# EAGLE design SKEMA ALAT UKUR-2025 (EAGLE 7.7.0)
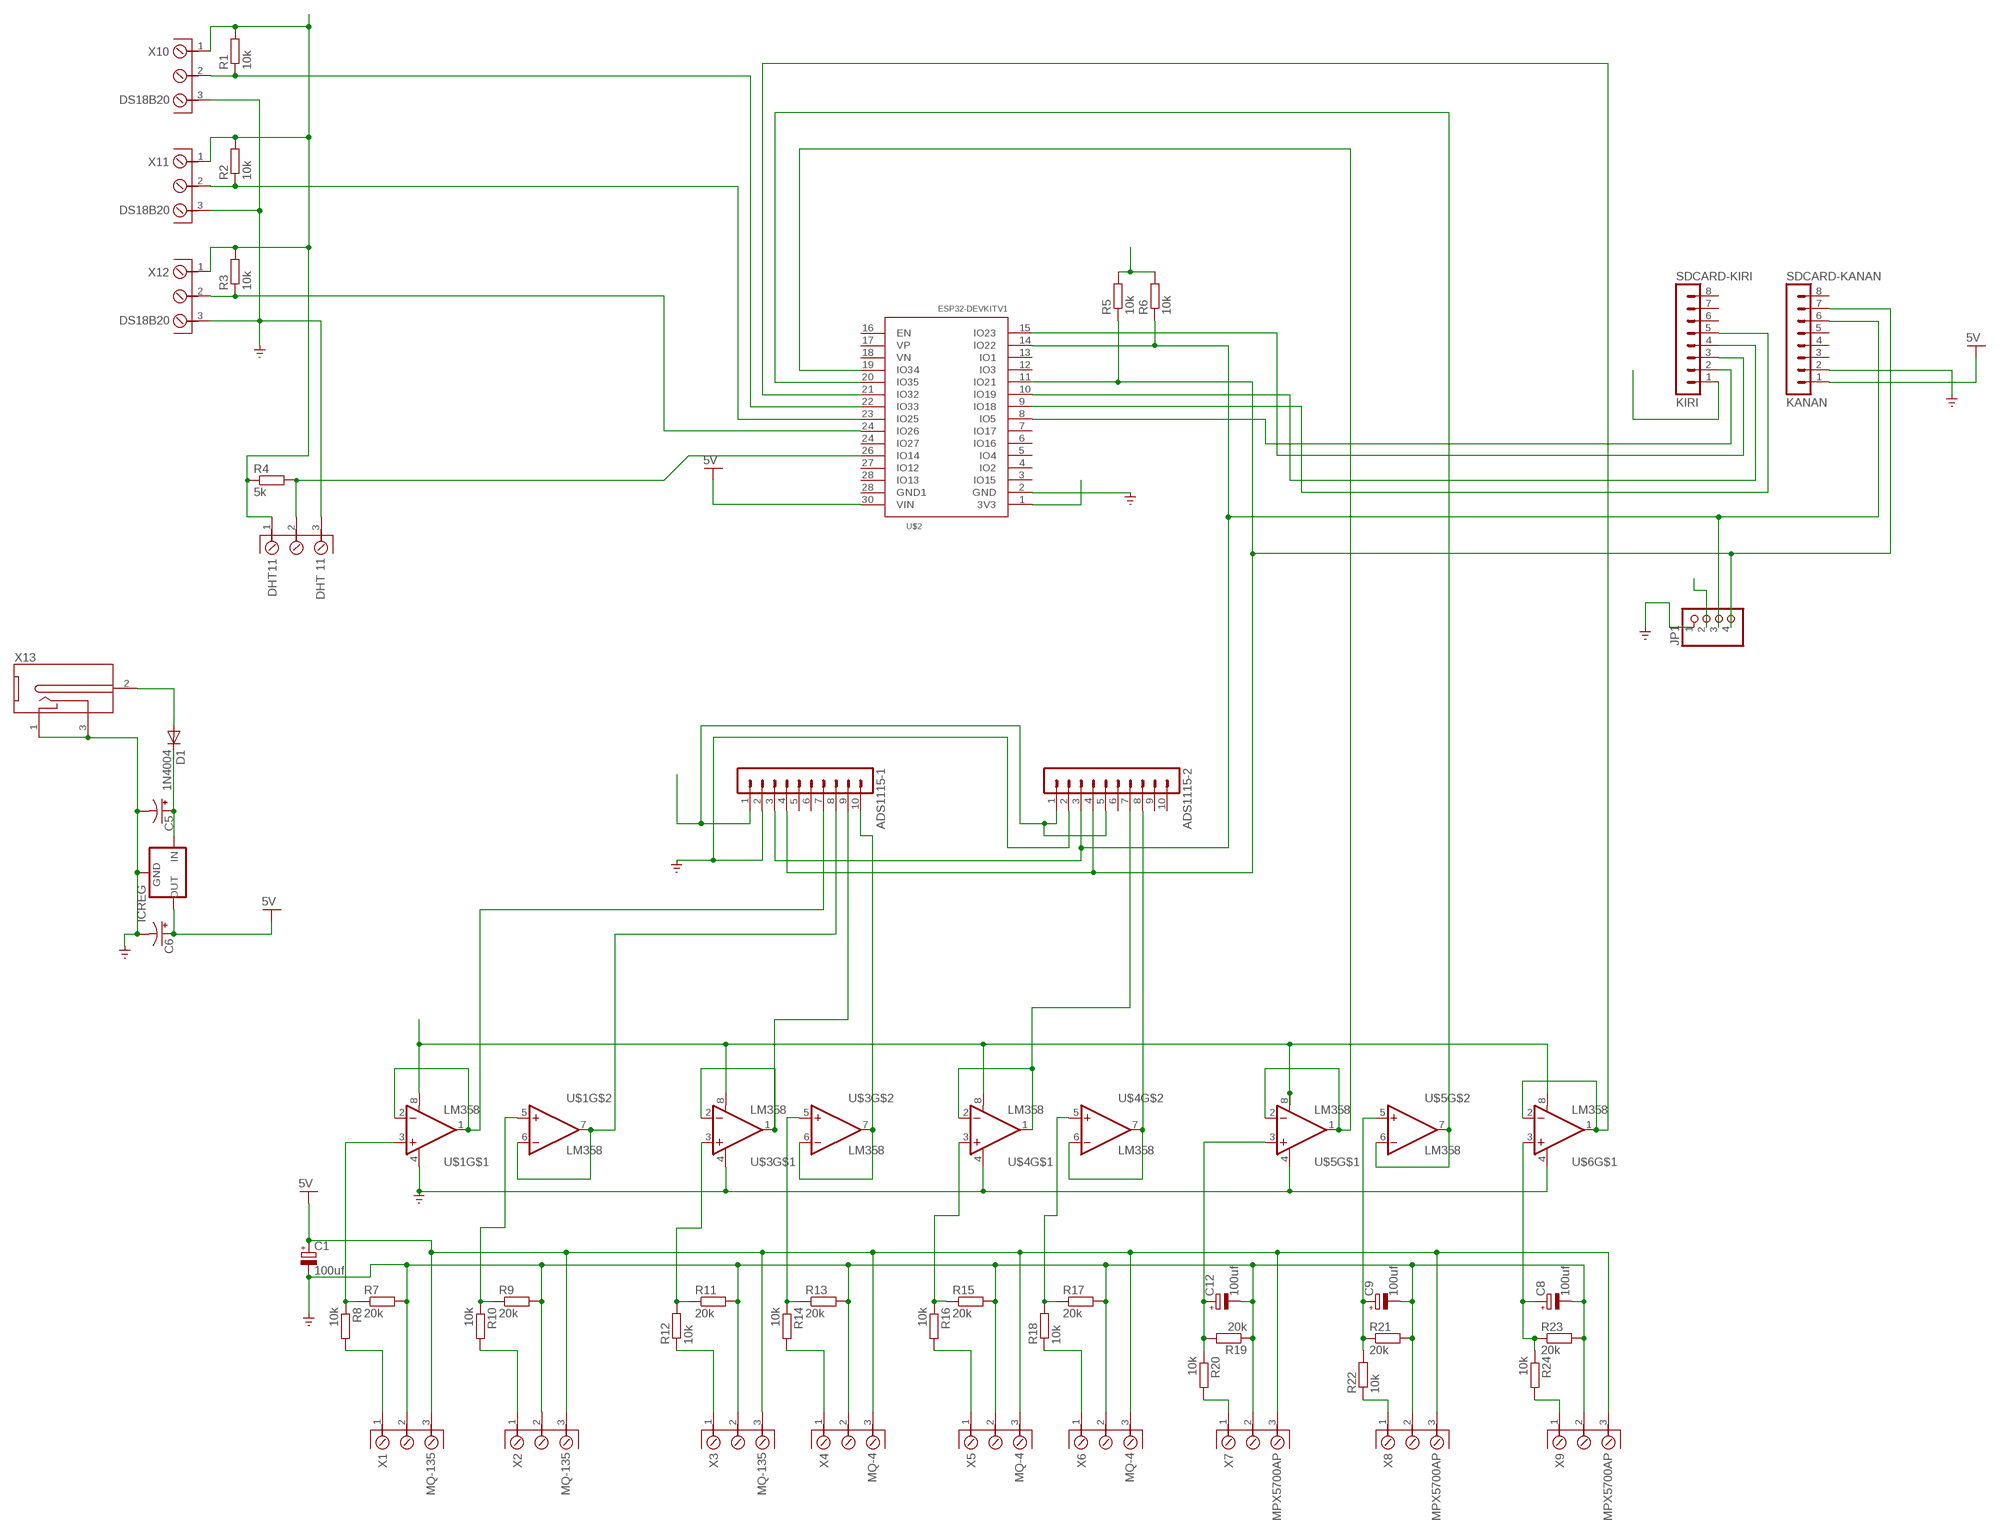
[diagram p0: schematic, sheet 1]

## Parts
ADS1115-1  MA10-1  [MA10-1]
ADS1115-2  MA10-1  [MA10-1]
C1  100uf  CPOL-EUE5-10.5  [E5-10,5]
C5  CPOL-USE5-13  [E5-13]
C6  CPOL-USE5-13  [E5-13]
C8  100uf  CPOL-EUE5-10.5  [E5-10,5]
C9  100uf  CPOL-EUE5-10.5  [E5-10,5]
C12  100uf  CPOL-EUE5-10.5  [E5-10,5]
D1  1N4004  [DO41-10]
DHT11  DHT 11  AKL701_3_13  [AKL701_3_13]
ICREG  78XXS  [78XXS]
JP1  PINHD-1X4  [1X04]
R1  10k  R-EU_0411/12  [0411/12]
R2  10k  R-EU_0411/12  [0411/12]
R3  10k  R-EU_0411/12  [0411/12]
R4  5k  R-EU_0411/12  [0411/12]
R5  10k  R-EU_0411/12  [0411/12]
R6  10k  R-EU_0411/12  [0411/12]
R7  20k  R-EU_0411/12  [0411/12]
R8  10k  R-EU_0411/12  [0411/12]
R9  20k  R-EU_0411/12  [0411/12]
R10  10k  R-EU_0411/12  [0411/12]
R11  20k  R-EU_0411/12  [0411/12]
R12  10k  R-EU_0411/12  [0411/12]
R13  20k  R-EU_0411/12  [0411/12]
R14  10k  R-EU_0411/12  [0411/12]
R15  20k  R-EU_0411/12  [0411/12]
R16  10k  R-EU_0411/12  [0411/12]
R17  20k  R-EU_0411/12  [0411/12]
R18  10k  R-EU_0411/12  [0411/12]
R19  20k  R-EU_0411/12  [0411/12]
R20  10k  R-EU_0411/12  [0411/12]
R21  20k  R-EU_0411/12  [0411/12]
R22  10k  R-EU_0411/12  [0411/12]
R23  20k  R-EU_0411/12  [0411/12]
R24  10k  R-EU_0411/12  [0411/12]
SDCARD-KANAN  KANAN  MA08-1  [MA08-1]
SDCARD-KIRI  KIRI  MA08-1  [MA08-1]
U$1  LM358  [DIP08]
U$2  ESP32DEVKITV1  [ESP32-DEVKITV1]
U$3  LM358  [DIP08]
U$4  LM358  [DIP08]
U$5  LM358  [DIP08]
U$6  LM358  [DIP08]
X1  MQ-135  AKL701_3_13  [AKL701_3_13]
X2  MQ-135  AKL701_3_13  [AKL701_3_13]
X3  MQ-135  AKL701_3_13  [AKL701_3_13]
X4  MQ-4  AKL701_3_13  [AKL701_3_13]
X5  MQ-4  AKL701_3_13  [AKL701_3_13]
X6  MQ-4  AKL701_3_13  [AKL701_3_13]
X7  MPX5700AP  AKL701_3_13  [AKL701_3_13]
X8  MPX5700AP  AKL701_3_13  [AKL701_3_13]
X9  MPX5700AP  AKL701_3_13  [AKL701_3_13]
X10  DS18B20  AKL701_3_13  [AKL701_3_13]
X11  DS18B20  AKL701_3_13  [AKL701_3_13]
X12  DS18B20  AKL701_3_13  [AKL701_3_13]
X13  DC-2.1MM-5MM  [DC-21MM]

## Nets
3.3V: ADS1115-1.1 ADS1115-2.1 ADS1115-2.5 DHT11.1 JP1.2 R1.2 R2.2 R3.2 R4.1 R5.2 R6.2 SDCARD-KIRI.1 U$1.8(V+) U$2.1(3V3) U$3.8(V+) U$4.8(V+) U$5.8(V+) U$6.8(V+) X10.1 X11.1 X12.1
GND: ADS1115-1.2 ADS1115-2.2 C1.- C5.- C6.- C8.- C9.- C12.- DHT11.3 ICREG.GND JP1.1 R7.2 R9.2 R11.2 R13.2 R15.2 R17.2 R19.1 R21.2 R23.2 SDCARD-KANAN.2 U$1.4(V-) U$2.2(GND) U$3.4(V-) U$4.4(V-) U$5.4(V-) U$6.4(V-) X1.2 X2.2 X3.2 X4.2 X5.2 X6.2 X7.2 X8.2 X9.2 X10.3 X11.3 X12.3 X13.1 X13.3 ; supply symbol labelled GND_
N$1: ADS1115-1.7 U$1.1(OUT) U$1.2(-IN)
N$2: R10.2 X2.1
N$3: R9.1 R10.1 U$1.5(+IN)
N$4: ADS1115-1.8 U$1.6(-IN) U$1.7(OUT)
N$5: ADS1115-1.9 U$3.1(OUT) U$3.2(-IN)
N$6: ADS1115-1.10 U$3.6(-IN) U$3.7(OUT)
N$7: R13.1 R14.1 U$3.5(+IN)
N$8: R14.2 X4.1
N$9: R15.1 R16.1 U$4.3(+IN)
N$10: ADS1115-2.7 U$4.1(OUT) U$4.2(-IN)
N$11: ADS1115-2.8 U$4.6(-IN) U$4.7(OUT)
N$12: R17.1 R18.2 U$4.5(+IN)
N$13: U$2.19(IO34) U$5.1(OUT) U$5.2(-IN)
N$14: U$2.20(IO35) U$5.6(-IN) U$5.7(OUT)
N$15: U$2.21(IO32) U$6.1(OUT) U$6.2(-IN)
N$16: ADS1115-1.3 ADS1115-2.3 JP1.3 R6.1 SDCARD-KANAN.6 U$2.14(IO22)
N$17: R3.1 U$2.24(IO26) X12.2
N$18: C8.+ R23.1 R24.1 U$6.3(+IN)
N$20: DHT11.2 R4.2 U$2.26(IO14)
N$22: ADS1115-1.4 ADS1115-2.4 JP1.4 R5.1 SDCARD-KANAN.7 U$2.11(IO21)
N$23: R2.1 U$2.23(IO25) X11.2
N$24: R16.2 X5.1
N$25: R7.1 R8.1 U$1.3(+IN)
N$26: SDCARD-KIRI.2 U$2.8(IO5)
N$27: R1.1 U$2.22(IO33) X10.2
N$28: SDCARD-KIRI.3 U$2.15(IO23)
N$29: SDCARD-KIRI.4 U$2.10(IO19)
N$30: SDCARD-KIRI.5 U$2.9(IO18)
N$31: R8.2 X1.1
N$32: R12.1 X3.1
N$33: R11.1 R12.2 U$3.3(+IN)
N$34: R18.1 X6.1
N$35: C12.+ R19.2 R20.1 U$5.3(+IN)
N$36: R20.2 X7.1
N$37: C9.+ R21.1 R22.2 U$5.5(+IN)
N$38: R22.1 X8.1
N$39: R24.2 X9.1
N$41: C5.+ D1.C ICREG.IN
N$43: D1.A X13.2
VCC: C1.+ C6.+ ICREG.OUT SDCARD-KANAN.1 U$2.30(VIN) X1.3 X2.3 X3.3 X4.3 X5.3 X6.3 X7.3 X8.3 X9.3 ; supply symbol labelled 5V
Unconnected: ADS1115-1.5 ADS1115-1.6 ADS1115-2.6 ADS1115-2.9 ADS1115-2.10 SDCARD-KANAN.3 SDCARD-KANAN.4 SDCARD-KANAN.5 SDCARD-KANAN.8 SDCARD-KIRI.6 SDCARD-KIRI.7 SDCARD-KIRI.8 U$2.3(IO15) U$2.4(IO2) U$2.5(IO4) U$2.6(IO16) U$2.7(IO17) U$2.12(IO3) U$2.13(IO1) U$2.16(EN) U$2.17(VP) U$2.18(VN) U$2.24(IO27) U$2.27(IO12) U$2.28(GND1) U$2.28(IO13) U$6.5(+IN) U$6.6(-IN) U$6.7(OUT)

## Library data of the parts
ADS1115-1 ADS1115-2 = con-lstb:MA10-1: PIN HEADER; OC_FARNELL: unknown; OC_NEWARK: unknown
C1 C8 C9 C12 = rcl:CPOL-EU: POLARIZED CAPACITOR, European symbol
C5 C6 = rcl:CPOL-US: POLARIZED CAPACITOR, American symbol
D1 = diode:1N4004: DIODE general purpose rectifier, 1 A
DHT11 X1-X12 = _con_riacon_akl701:AKL701_3*: RIACON (Ria Connect) Screw Type Terminal Block Type AKL 701 - 3 (pole-size: 3) centerline 6.35 mm / 0.250 inches, 400 V / 24 A, horizontal wire entry, lift system, modular packages: _13: recommended pcb hole dia. = 1,3 mm _15: pcb hole dia. = 1,5 mm (prototyping) Auhtor: Dipl.-Ing. FH Rainer Bayer, Hochschule Heilbronn (rainer.bayer@hs-heilbronn.de)
ICREG = v-reg-3:78XXS: VOLTAGE REGULATOR
JP1 = pinhead:PINHD-1X4: PIN HEADER
R1-R24 = resistor:R-EU_: RESISTOR, European symbol
SDCARD-KANAN SDCARD-KIRI = con-lstb:MA08-1: PIN HEADER; OC_FARNELL: unknown; OC_NEWARK: unknown
U$1 U$3-U$6 = SparkFun:LM358
U$2 = ESP32-DEVKITV1:ESP32DEVKITV1
X13 = power-jack:DC: 5mm x 2.1mm jack

## Board
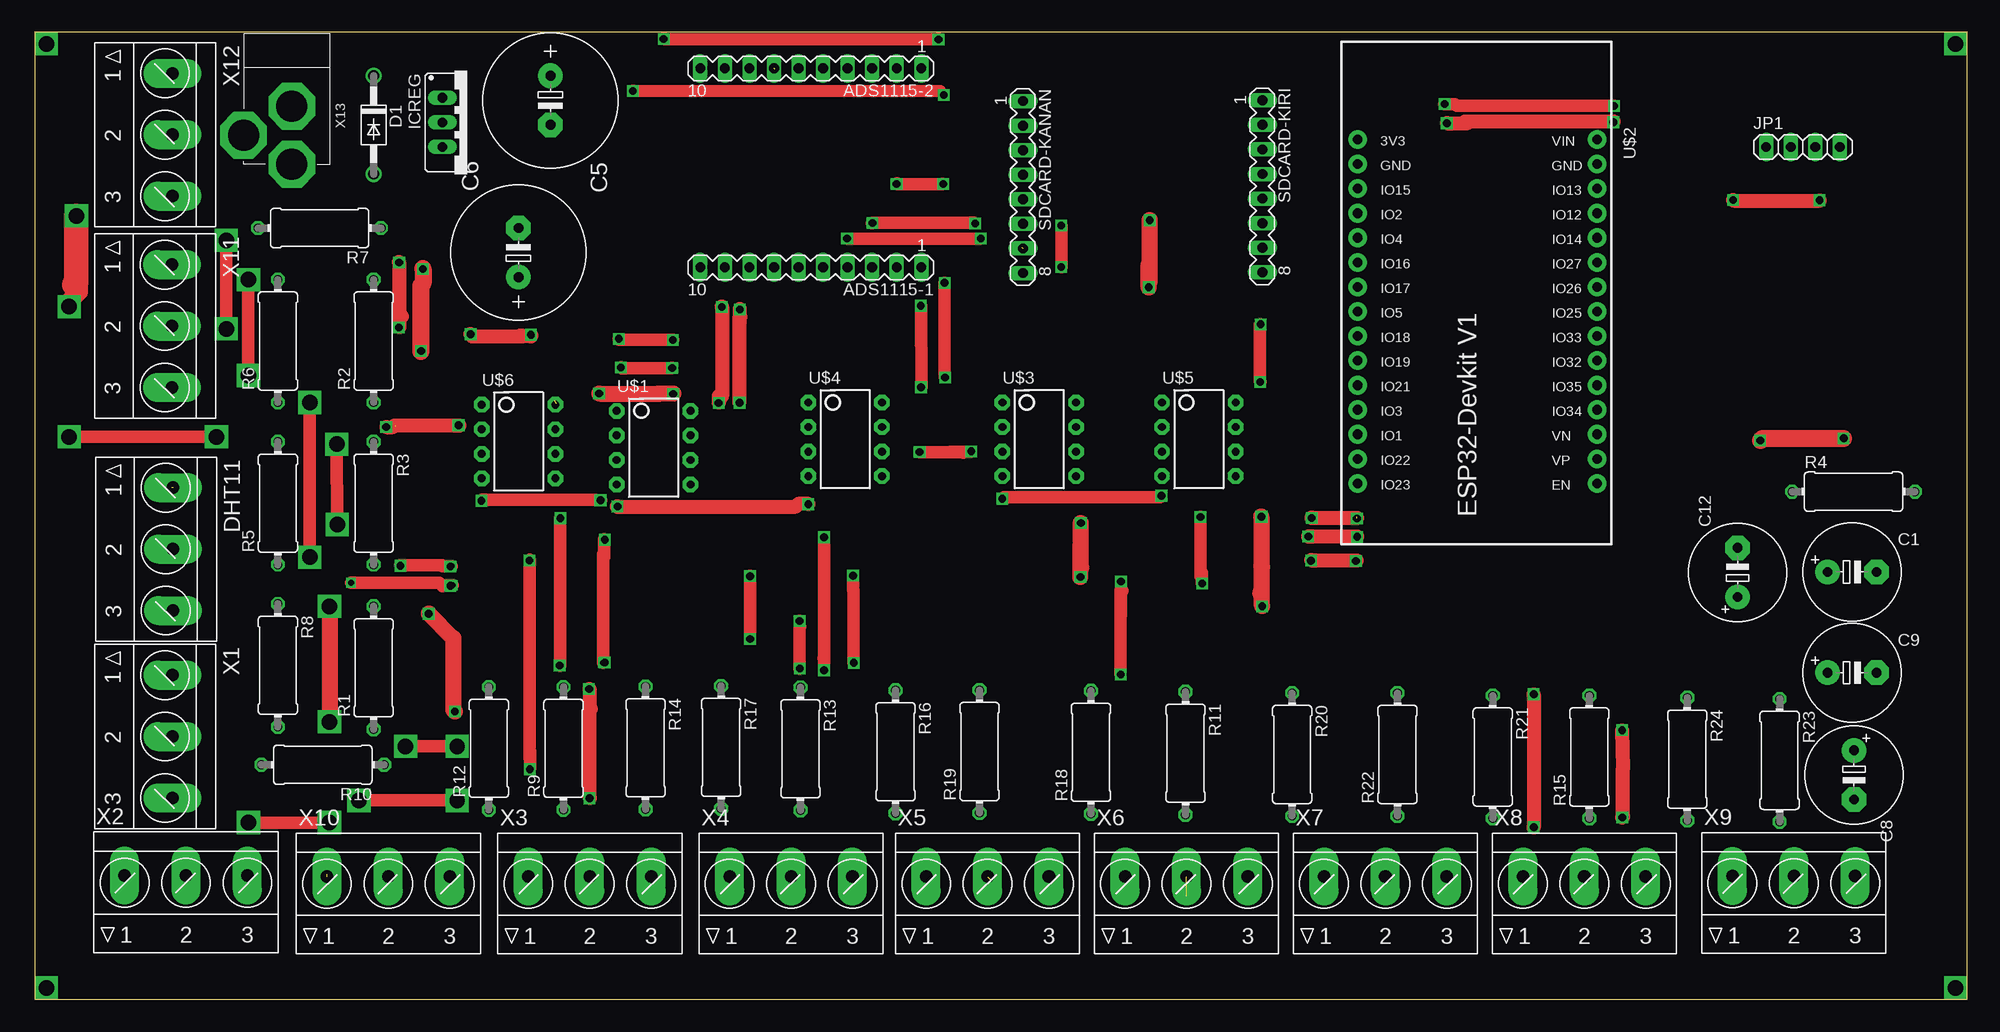
[diagram p1: board, top side]
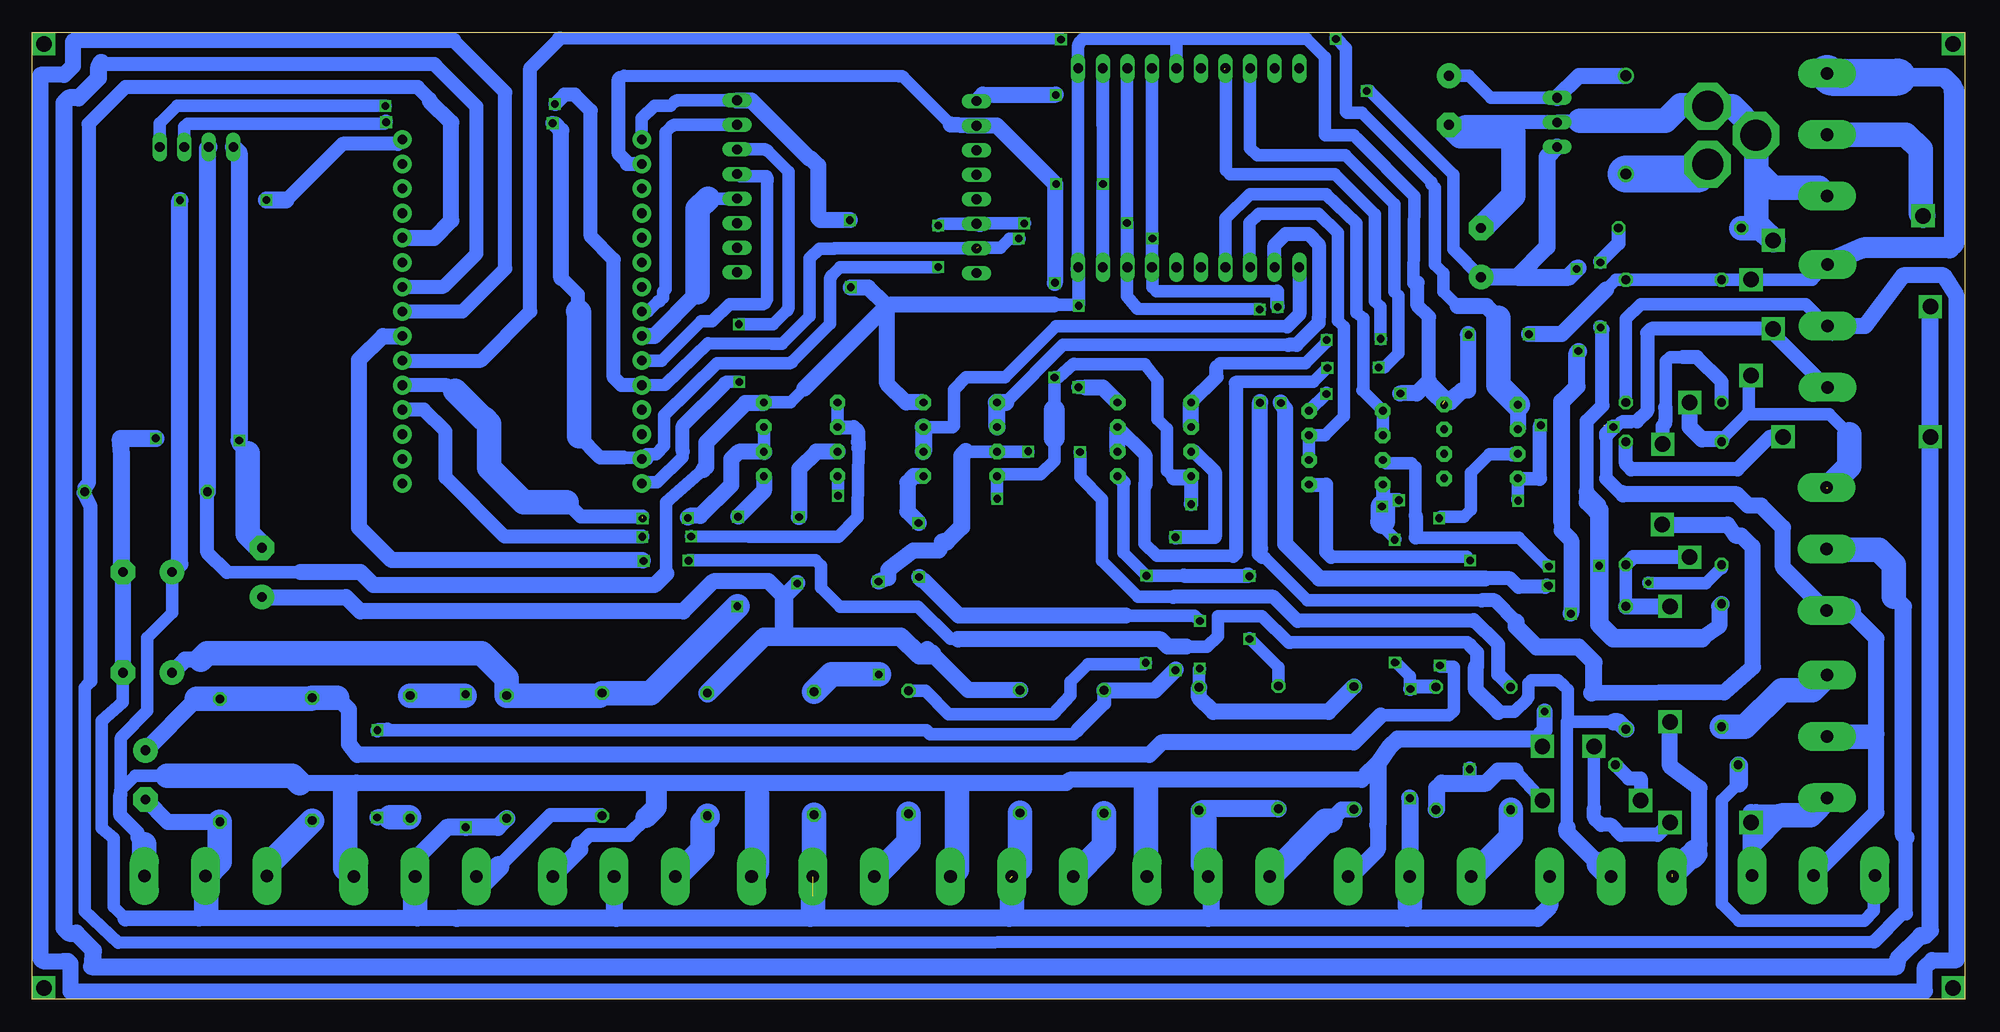
[diagram p2: board, bottom side, seen from below]

Size 199.88 x 100 mm. Coordinates in mm from the lower left corner, seen from the top.
Outline: 0,0 199.88,0 199.88,100 0,100 0,0
Copper layers (1*16): Top 0.035mm / dielectric 1.5mm / Bottom 0.035mm
Design rules "default *": minimum track width 10mil, minimum drill 24mil, track to track 60mil, track to pad 60mil, pad to pad 60mil, via to via 60mil, smd to smd 60mil, copper to edge 0mil, drill to drill 8mil, minimum pad ring 10mil, minimum via ring 8mil, stop-mask expansion 4mil, vias tented up to drill 0mil, thermal gap 10mil

### Footprints (pad centres in the part's own frame; a part is rotated, then mirrored left to right if it is on the bottom)
MA10-1 = drill 1.016 long: 1 -11.43,0; 2 -8.89,0; 3 -6.35,0; 4 -3.81,0; 5 -1.27,0; 6 1.27,0; 7 3.81,0; 8 6.35,0; 9 8.89,0; 10 11.43,0
E5-10,5 = drill 1.016 pad 2.54: + -2.54,0 | drill 1.016 pad 2.54 octagon: - 2.54,0
E5-13 = drill 1.016 pad 2.54: + -2.54,0 | drill 1.016 pad 2.54 octagon: - 2.54,0
DO41-10 = drill 1.118: A 5.08,0; C -5.08,0
AKL701_3_13 = drill 1.3 pad 3 long: 1 -6.35,0; 2 0,0; 3 6.35,0
78XXS = drill 1.016 long: GND 0,-2.54; IN -2.54,-2.54; OUT 2.54,-2.54
1X04 = drill 1.016 long: 1 -3.81,0; 2 -1.27,0; 3 1.27,0; 4 3.81,0
0411/12 = drill 0.914 octagon: 1 -6.35,0; 2 6.35,0
MA08-1 = drill 1.016 long: 1 -8.89,0; 2 -6.35,0; 3 -3.81,0; 4 -1.27,0; 5 1.27,0; 6 3.81,0; 7 6.35,0; 8 8.89,0
DIP08 = drill 0.813 pad 1.6 octagon: 1 -3.81,-3.81; 2 -1.27,-3.81; 3 1.27,-3.81; 4 3.81,-3.81; 5 3.81,3.81; 6 1.27,3.81; 7 -1.27,3.81; 8 -3.81,3.81
ESP32-DEVKITV1 = drill 1 pad 1.93: 1 -22.87,-13.54; 2 -20.33,-13.54; 3 -17.79,-13.54; 4 -15.25,-13.54; 5 -12.71,-13.54; 6 -10.17,-13.54; 7 -7.63,-13.54; 8 -5.09,-13.54; 9 -2.55,-13.54; 10 -0.01,-13.54; 11 2.53,-13.54; 12 5.07,-13.54; 13 7.61,-13.54; 14 10.15,-13.54; 15 12.69,-13.54; 16 12.69,11.23; 17 10.15,11.23; 18 7.61,11.23; 19 5.07,11.23; 20 2.53,11.23; 21 -0.01,11.23; 22 -2.55,11.23; 23 -5.09,11.23; 24 -7.63,11.23; 25 -10.17,11.23; 26 -12.71,11.23; 27 -15.25,11.23; 28 -17.79,11.23; 29 -20.33,11.23; 30 -22.87,11.23
DC-21MM = drill 3.2 pad 4.826 octagon: 1 -5.08,-3.353; 2 -0.076,-6.35; 3 -0.076,-0.356

### Placement (x,y rotation side)
ADS1115-1  80.26,75.69 180 top
ADS1115-2  80.26,96.27 180 top
C1  187.96,44.2 0 top
C5  53.34,92.96 270 top
C6  50.04,77.22 90 top
C8  188.16,23.22 270 top
C9  187.96,33.78 0 top
C12  176.12,44.15 90 top
D1  35.05,90.42 270 top
DHT11  14.3,46.56 270 top
ICREG  44.7,90.68 270 top
JP1  182.88,88.14 0 top
R1  35.05,34.29 90 top
R2  35.05,68.07 90 top
R3  35.05,51.31 270 top
R4  188.11,52.5 0 top
R5  25.15,51.31 90 top
R6  25.15,68.07 90 top
R7  29.46,79.76 180 top
R8  25.15,34.54 270 top
R9  54.69,25.96 90 top
R10  29.79,24.26 180 top
R11  119.02,25.45 270 top
R12  46.96,25.96 90 top
R13  79.2,25.91 270 top
R14  63.17,26.01 270 top
R15  160.78,25.07 90 top
R16  89.03,25.6 270 top
R17  70.99,26.06 270 top
R18  109.25,25.55 90 top
R19  97.71,25.63 90 top
R20  130.05,25.32 270 top
R21  150.8,25.07 270 top
R22  140.94,25.32 90 top
R23  180.47,24.71 270 top
R24  170.92,24.84 270 top
SDCARD-KANAN  102.21,84 270 top
SDCARD-KIRI  126.97,84.07 270 top
U$1  64.01,57.05 270 top
U$2  150.37,66.04 270 top
U$3  103.89,57.91 270 top
U$4  83.82,57.91 270 top
U$5  120.4,57.91 270 top
U$6  50.04,57.68 270 top
X1  14.22,27.18 270 top
X2  15.65,12.83 0 top
X3  57.4,12.7 0 top
X4  78.23,12.7 0 top
X5  98.55,12.7 0 top
X6  119.13,12.7 0 top
X7  139.7,12.7 0 top
X8  160.27,12.7 0 top
X9  181.94,12.75 0 top
X10  36.58,12.7 0 top
X11  14.2,69.62 270 top
X12  14.22,89.41 270 top
X13  26.67,92.71 0 top

### Tracks (layer width: path | path; a pad name or v marks a point on that pad's centre or on a via)
3.3V  (via drill 0.6, 0.8, 1.6)  (3 unrouted)
  Top 1.27: v22.1,64.52 v22.1,74.42 | v28.45,45.72 v28.45,61.72 | v91.69,63.3 91.67,71.68 v91.64,71.7
  Top 1.422: v45.03,68.78 45.26,68.56 50.44,68.56 | 50.44,68.56 50.39,68.61 50.39,68.63 50.22,68.63 | v51.38,68.63 51.31,68.56 50.44,68.56
  Top 1.676: v30.48,40.64 v30.48,28.7 | v115.32,80.59 v115.32,80.57 115.32,76.07 | 115.32,76.07 115.32,74.22 | v115.21,73.64 115.21,75.97 115.32,76.07 | v58.4,62.66 58.42,62.64 64.52,62.64 | 64.52,62.64 64.54,62.61 | v66.04,62.64 64.52,62.64
  Bottom 1.016: 133.47,92.78 arc45 133.02,92.96
  Bottom 1.27: 81.53,99.31 68.07,99.31 66.17,97.41 66.17,89.41 66.12,89.36 63.17,89.36 62.8,88.99 56.92,83.03 57.02,74.04 56.59,74.14 | 81.53,99.31 91.19,99.31 91.51,98.99 arc-45 91.69,98.54 ADS1115-2.1 ADS1115-1.1 91.87,75.51 | ADS1115-2.5 81.53,99.31 | SDCARD-KIRI.1 127,92.96 133.02,92.96 arc-45 133.47,92.78 133.84,92.41 135.51,92.41 136.83,91.09 U$2.1 | 14.17,52.91 14.48,53.21 | X11.1 15.75,74.42 v22.1,74.42 R6.2 R2.2 36.07,74.42 37.08,73.41 | v22.1,64.52 22.35,64.26 22.35,60.71 22.54,60.52 | 22.54,60.52 25.15,57.91 R5.2 | R3.2 R1.2 | 11.94,58.42 14.03,60.52 22.54,60.52 | 119.28,63.91 120.02,63.17 121.46,61.72 U$5.8 124.28,61.65 | 130.48,54.76 134.31,51.41 134.31,44.02 | 91.87,75.51 91.59,75.51 91.64,75.46 v91.64,71.73 v91.64,71.7 | 91.87,75.51 91.62,75.26 91.62,71.86 91.64,71.83 94.23,71.83 | U$1.8 v66.04,62.64 66.04,62.71 | 170.26,44.17 172.16,44.17 179.73,44.17 | 51.38,68.81 v51.31,68.73 51.21,68.63 51.21,63.48 53.11,61.57 54,61.57
  Bottom 1.422: 27.94,15.24 27.43,15.75 27.43,16 | 90.93,63.25 90.98,63.3 v91.67,63.3 v91.69,63.3 | v28.45,45.72 34.29,45.72 R3.2 | 179.73,44.17 181.76,46.2 R4.1 | 54,61.57 55.09,62.66 | 55.04,63.17 53.75,61.87 53.39,61.87 55.42,63.91 55.42,70.56 56.59,71.73 56.59,74.14
  Bottom 1.676: 27.43,14.99 27.43,16 27.43,21.84 30.48,24.13 v30.48,28.7 | R1.2 v30.48,40.64 | U$4.8 89.15,63.25 90.93,63.25 | 37.08,73.41 41.71,68.78 v45.03,68.78 | 51.38,68.81 v51.38,68.63 51.38,62.94 52.02,62.94 U$6.8 | 25.15,57.91 27.18,57.91 28.45,59.18 v28.45,61.72 | 124.28,61.65 126.11,61.65 130.18,57.58 130.18,55.07 130.48,54.76 | 94.23,71.83 111.02,71.83 111.4,71.45 | 111.4,71.45 111.73,71.45 | 111.73,71.45 120.02,63.17 | U$3.8 109.5,61.72 111.45,63.68 111.45,71.4 111.4,71.45 | 111.73,71.45 111.73,71.96 113.39,73.61 115.19,73.61 v115.21,73.64 | 127,92.96 125.53,92.96 119.51,86.94 119.33,86.94 118.59,86.21 118.59,80.8 118.39,80.59 v115.32,80.59 | 55.42,63.91 56.67,62.66 v58.4,62.66 | 134.31,44.02 135.51,42.82 164.57,42.82 165.91,44.17 172.16,44.17
  Bottom 1.778: JP1.2 181.76,87.99 R4.1
  Bottom 1.93: 6.96,95.35 2.11,95.35 1.22,94.46 1.22,94.06 1.09,93.93
  Bottom 2.184: 1.09,93.93 1.09,78.21 1.6,77.7 10.52,77.7 13.46,76.43 X11.1
  Bottom 2.54: 14.17,52.91 11.94,55.14 11.94,58.42 | 30.23,12.95 28.45,14.73 28.19,14.73 27.94,14.99 27.94,15.24
  Bottom 3.81: X12.1 13.82,95.35 6.96,95.35
GND  (via drill 0.6, 0.8, 1.6)  (3 unrouted)
  Top 1.27: v19.81,78.49 v19.81,69.34 | v100.08,51.77 100.25,51.94 116.38,51.94 v116.53,52.1 | v94.13,64.34 94.11,64.85 v94.11,74.09 | v89.18,84.38 89.26,84.3 93.85,84.3 v93.9,84.35 | v46.25,51.64 57.84,51.64 57.81,51.66 58.01,51.64 v58.6,51.61 | v58.78,34.8 58.78,45.59 | 58.78,45.59 58.78,46.05 58.85,46.13 | v58.88,47.57 58.88,45.7 58.78,45.59
  Top 1.422: v57.4,20.83 57.4,29.92 57.53,30.05 57.38,30.2 v57.38,32.11 | v155.04,31.52 v155.04,17.8 v155.04,17.78 | v43.92,59.33 37.31,59.33 | 37.47,59.33 37.24,59.33 37.19,59.28 37.14,59.28 37.03,59.18 v36.37,59.18 | v60.2,50.95 v60.27,50.95 78.72,50.95 78.99,51.23 v80.01,51.23
  Top 1.778: v178.49,57.81 178.69,58.01 v187.1,58.01
  Bottom 0.254: 42.06,90.86 ICREG.GND | 13.95,40.56 DHT11.3
  Bottom 1.27: 42.06,90.86 39.8,90.86 | 104.88,90.48 109.77,95.37 arc-45 110.22,95.43 138.68,95.5 139.11,95.26 139.26,95.17 | 89.18,90.42 89.18,96.24 ADS1115-2.2 ADS1115-1.2 89.18,75.72 v89.18,84.38 | 14.25,63.27 X11.3 | 20.32,69.34 v19.81,69.34 | 34.54,59.69 35.46,59.69 | 35.46,59.69 35.56,59.69 37.08,58.17 37.08,53.85 | 160.27,9.14 160.02,8.89 160.02,8.38 | 181.86,8.89 182.37,8.38 182.63,8.38 | 98.55,8.89 98.81,8.64 98.81,8.38 | C9.- 190.5,30.73 192.68,28.83 192.68,17.68 191.44,16.64 191.44,9.58 190.22,8.36 | v100.08,51.77 U$3.4 99.9,54.28 95.58,54.28 94.16,55.7 94.16,58.04 | U$5.4 116.53,54.05 v116.53,52.1 | 94.11,84.35 v93.9,84.35 | 51.82,90.68 52.07,90.42 C5.- | 81.79,53.95 82.5,54.66 82.5,59 83.49,60 83.49,64.03 84.8,65.65 92.22,65.65 | 92.13,65.71 92.22,65.65 | 92.22,65.65 93.73,64.34 v94.13,64.34 v94.16,64.31 94.16,60.96 | U$6.4 46.23,52.2 v46.25,51.64 | 33.91,59.77 35.38,59.77 35.46,59.69 | 60.22,49.4 60.22,48.92 v58.88,47.57 | v57.38,32.11 57.38,33.4 v58.78,34.8
  Bottom 1.422: ICREG.GND 51.82,90.68 | 14.25,63.27 20.32,69.34 32.41,69.34 32.84,68.91 32.84,60.83 33.91,59.77 | 119.13,9.14 119.38,8.89 119.38,8.38 | 57.4,9.65 57.66,9.4 57.66,8.38 | 9.91,27.18 9.65,27.43 9.14,27.43 | R9.2 57.18,32.31 v57.38,32.11 | 37.08,58.17 37.08,58.52 36.37,59.23 v36.37,59.18 | U$4.4 v80.01,51.23 80.03,51.21 | v43.92,59.33 43.94,59.31 43.94,53.87 43.99,53.82 U$6.4 | v58.6,51.61 60.2,51.61 v60.2,50.95 U$1.4 | 35.46,52.35 35.59,52.35 37.08,53.85 | 155.14,31.42 v155.04,31.52 | 177.6,56.46 178.49,57.35 v178.49,57.81 | U$2.2 138.39,86.37 138.39,86.6 139.22,87.43 139.22,95.15 139.11,95.26
  Bottom 1.676: X2.2 9.14,19.33 9.14,27.43 9.14,37.34 12.01,40.21 | DHT11.3 18.8,44.7 18.8,48.77 21.08,51.05 22.4,51.05 23.57,52.22 35.33,52.22 35.46,52.35 | 155.96,8.38 160.02,8.38 182.63,8.38 190.22,8.36 | C1.- C9.- | C8.- 185.85,18.36 R23.2 | 104.88,90.48 103.07,90.37 101.35,90.37 | 101.35,90.37 101.37,90.35 SDCARD-KANAN.2 | 101.35,90.37 100.13,90.37 94.11,84.35 v94.11,74.09 | U$4.4 80.16,53.95 81.79,53.95
  Bottom 1.778: v57.4,20.83 X3.2 | 139.45,8.38 155.96,8.38 | X7.2 139.7,8.64 139.45,8.38 | X10.3 42.93,9.65 44.2,8.38 57.66,8.38 78.23,8.38 | 78.23,8.38 98.81,8.38 119.38,8.38 139.45,8.38 | X4.2 78.23,18.59 R13.2 | R13.2 79.2,13.92 77.98,12.7 77.98,8.64 78.23,8.38 | R17.2 79.05,19.71 R13.2 | R21.2 151.74,17.78 v155.04,17.78 156.97,17.78 160.27,14.48 160.27,12.19 | JP1.1 178.49,87.55 v178.49,57.81 | C1.- 190.63,44.32 190.63,56.34 190.75,58.01 v187.1,58.01
  Bottom 2.184: 94.16,58.04 94.16,60.96
  Bottom 2.54: X8.2 160.27,12.19 160.27,9.14 | 181.86,8.89 181.86,12.68 X9.2 180.47,14.22 R23.2 | 119.13,10.67 119.13,9.14 | 98.81,12.45 98.55,12.19 98.55,8.89 | X3.2 57.4,9.65 | X1.2 9.91,27.18 | DHT11.3 12.01,40.21 | C6.- 46.69,83.11 46.69,89.23 | 46.69,89.23 46.69,89.69 | C5.- 52.15,89.23 46.69,89.23 | X12.3 15.11,83.95 19.86,83.95 21.54,85.62 | 21.54,85.62 21.54,89.94 21.59,89.89 | 21.59,89.89 X13.1 | 21.59,89.89 24.05,92.35 X13.3 26.06,92.89 25.5,92.89 25.93,92.46 29.36,92.46 30.96,90.86 39.8,90.86 | v19.81,78.49 21.08,79.76 | 21.08,79.76 R7.2 | 21.08,79.76 21.54,80.21 21.54,85.62 | v60.2,50.95 60.2,49.43 60.22,49.4 | 155.14,31.42 R15.2 | C12.- 177.6,48.16 177.6,56.46 | X5.2 97.71,13.54 R19.1 | X6.2 119.02,12.8 R11.2
N$1
  Bottom 1.27: U$1.2 U$1.1 62.31,62.97 62.18,63.09 62.18,70.41 62.92,71.02 62.92,80.24 66.02,83.21 66.04,83.24 73.43,83.24 73.46,83.26 73.94,83.26 76.45,80.75 ADS1115-1.7
N$2
  Bottom 1.27: X2.1 9.4,12.72 9.4,9.14 10.41,8.13 23.37,8.13 25.15,9.91 25.15,20.57 23.37,22.35 | 23.37,24.18 R10.2
  Bottom 1.93: 23.37,24.18 23.37,22.35
N$3  (via drill 0.6, 0.8, 1.6)
  Top 1.27: v33.53,20.57 v43.69,20.57 | v51.21,45.44 51.21,25.68 | 51.21,25.68 51.21,24.92 51.23,24.89 | v51.23,23.88 51.23,25.65 51.21,25.68
  Bottom 1.27: 46.48,23.62 v43.69,20.57 | 33.53,20.62 v33.53,20.57 | 65.53,45.75 51.51,45.75 v51.21,45.44
  Bottom 1.422: R10.1 34.75,22.86 33.53,22.86 v33.53,20.57 | 54.1,22.35 51.44,22.35 51.21,22.58 v51.21,23.8 51.21,23.85 v51.23,23.88 | U$1.5 66.06,53.24 66.06,46.28 65.53,45.75
  Bottom 1.778: R9.1 54.61,19.68 54.61,21.84 54.1,22.35 49.53,22.35 48.26,23.62 46.48,23.62
N$4
  Bottom 1.27: U$1.6 U$1.7 66.19,58.32 64.21,60.3 64.24,60.33 64.24,69.55 64.85,70.16 64.85,79.25 66.83,81.23 73.03,81.23 73.97,80.29 73.97,75.74 ADS1115-1.8
N$5
  Bottom 1.27: 99.16,61.72 99.19,61.72 | 99.19,61.72 U$3.1 | 69.98,67.67 93.24,67.67 99.19,61.72
  Bottom 1.422: ADS1115-1.9 71.37,78 70.23,79.15 67.89,79.15 66.8,78.05 66.8,70.46 66.83,70.43 66.83,69.95 69.11,67.67 69.98,67.67
  Bottom 1.778: U$3.2 U$3.1 99.97,61.62 99.9,61.62 99.97,61.7 100.15,61.7 100.1,61.65 100.1,61.62 100,61.72 99.19,61.72
N$6
  Bottom 1.27: 69.98,69.6 70.08,69.6 94,69.6 99.29,64.31 103.28,64.31 104.55,63.04 104.55,59.33 104.7,59.18 U$3.7
  Bottom 1.422: ADS1115-1.10 68.83,70.84 70.08,69.6
  Bottom 1.778: U$3.7 U$3.6
N$7  (via drill 0.6, 0.8)
  Top 1.27: v79.12,34.21 79.12,38.12 | 79.12,38.12 79.12,38.48 79.17,38.53 | v79.1,39.14 v79.1,39.12 79.1,38.15 79.12,38.12
  Top 1.676: v108.18,49.28 108.18,46.97 | 108.18,46.97 108.18,44.76 108.25,44.68 | v108.15,43.66 108.15,46.94 108.18,46.97
  Bottom 1.27: 79.2,31.95 R13.1 79.2,34.14 v79.12,34.21 | 86.79,39.68 79.65,39.68 79.12,39.14 v79.1,39.14
  Bottom 1.676: R14.1 65.81,29.72 77.72,29.72 79.2,31.19 R13.1 | 86.79,39.68 104.04,39.68 107.75,43.38 107.87,43.38 v108.15,43.66 | U$3.5 108.71,54.1 109.37,53.44 109.37,50.47 v108.18,49.28
N$8
  Bottom 1.676: 65.63,18.47 64.44,19.66 R14.2
  Bottom 2.54: X4.1 66.12,18.47 65.63,18.47
N$9  (via drill 0.6, 0.8)
  Top 1.27: v81.64,47.78 81.64,35.28 81.61,35.26 81.64,35.23 v81.64,34.09
  Top 1.422: v164.19,18.82 164.26,18.9 164.26,23.9 v164.16,27.81
  Bottom 1.27: v164.16,27.81 107.39,27.81 107.01,27.43 92.2,27.43 91.82,27.81
  Bottom 1.422: R15.1 160.88,18.82 | U$4.3 79.68,56.64 77.57,54.53 77.57,47.83 77.6,47.8 81.61,47.8 v81.64,47.78 | R16.1 89.03,30.61 91.82,27.81 | 163.12,27.89 v164.16,27.81
  Bottom 1.676: 162.84,18.82 v164.19,18.82 | R16.1 83.77,31.95 v81.64,34.09
  Bottom 2.54: 160.88,18.82 162.84,18.82
N$10  (via drill 0.6, 0.8)  (1 unrouted)
  Top 1.27: v60.38,68.28 60.45,68.2 v66.02,68.2
  Bottom 1.27: 77.39,65.41 77.04,65.76 68.53,65.76 68.5,65.79 68.2,65.79 66.02,67.97 v66.02,68.2 | 76.56,96.16 76.4,96.01 76.4,85.73 76,85.32 65.13,85.32 61.01,81.2 61.01,72.19 60.43,71.6 60.43,68.33 v60.4,68.3 v60.38,68.28
  Bottom 1.422: U$4.1 77.39,64.34 77.39,65.41
  Bottom 1.676: U$4.2 U$4.1
N$11  (via drill 0.6)
  Top 1.27: v65.91,65.33 65.86,65.28 60.71,65.28 v60.63,65.35
  Bottom 1.27: 75.39,63.73 75.26,63.86 67.39,63.86 v65.91,65.33 | v60.63,65.35 60.05,65.35 58.57,66.83 58.57,72.77 58.98,73.18 58.98,82.22 64.03,87.27 73.18,87.27 73.91,88.01 ADS1115-2.8 | 75.67,45.85 83.57,45.85 84.84,47.12 84.84,53.06 84.76,53.14
  Bottom 1.422: U$4.7 84.76,56.31 84.76,53.32 | 84.76,53.32 84.76,53.14 | 75.39,63.73 75.39,46.13 75.67,45.85 | 84.73,53.29 84.76,53.32
  Bottom 1.676: U$4.6 U$4.7
N$12  (via drill 0.6, 0.8)
  Top 1.27: v84.71,34.82 84.71,42.29 84.63,42.37 v84.63,43.82 | v73.99,37.34 v73.99,43.76 v73.99,43.82
  Bottom 1.27: R17.1 70.99,34.34 v73.99,37.34 | 80.8,43.82 v84.63,43.82 87.02,46.2 87.02,53.44 87,53.47 | R18.2 107.49,31.9 105.13,29.49 94.28,29.49 92.51,31.47 92.51,32.87 90.7,34.67 84.86,34.67 v84.71,34.82
  Bottom 1.422: U$4.5 87,53.47 | 80.8,43.82 v73.99,43.82 74.09,43.92 74.22,43.92
N$13  (via drill 0.6)
  Top 1.422: v131.72,47.88 136.73,47.88 v136.75,47.85
  Bottom 1.27: U$5.1 U$5.2 | 114.43,57.02 114.53,50.34 114.53,49.84 116.46,47.85 125.75,47.85 125.75,47.83 v131.72,47.88
  Bottom 1.422: U$5.2 114.88,59.18 114.48,58.78 114.48,57.63 114.4,57.56 114.4,57.05 114.43,57.02 | v136.75,47.85 151,47.85 157.12,53.98 157.12,58.73 159.37,60.97 U$2.19
N$14  (via drill 0.6, 0.8)  (1 unrouted)
  Top 1.422: v132.06,49.81 v132.08,49.78 136.73,49.78 v136.75,49.76
  Bottom 1.27: U$5.6 U$5.7 124.18,59.16 124.18,56.62 | 131.85,49.81 v132.06,49.81
  Bottom 1.422: 136.75,49.91 143.13,49.91 144.63,51.41 | 156.13,62.92 156.36,62.92 156.95,63.5 161.59,63.5 U$2.20
  Bottom 1.676: 124.18,56.62 126.82,56.62 127.58,55.86 127.58,53.19 130.78,49.99 131.88,49.99 v132.06,49.81
  Bottom 2.54: 144.63,51.41 149.07,51.41 152.63,54.97 152.63,59.54 153.11,60.02 153.24,60.02 156.13,62.92
N$15  (via drill 0.6)
  Top 1.27: v65.08,99.37 65.18,99.26 93.42,99.26 v93.47,99.31
  Bottom 1.27: 145.47,99.37 145.29,99.37 v93.47,99.31 | v65.08,99.37 64.97,99.37 63.98,98.37 63.98,91.77 63.91,91.69 62.36,91.69 55.14,84.48 55.14,84.28 54.81,83.95 54.81,75.97 53.92,75.08 53.92,73.18 52.43,71.68
  Bottom 1.422: U$2.21 153.46,66.05 148.36,71.14 148.36,96.29 145.29,99.37
  Bottom 1.676: U$6.1 U$6.2 | 48.23,70.46 49.45,71.68 52.43,71.68
  Bottom 2.54: U$6.1 48.23,63.5 48.23,70.46
N$16  (via drill 0.6, 0.8, 1.6)
  Top 1.27: v31.29,49.1 v31.24,57.4 | v86.61,80.26 v86.64,80.29 86.66,80.31 97.16,80.31 v97.21,80.26 | v106.17,80.01 106.17,76.48 | 106.17,76.48 106.2,76.45 | v106.17,75.69 v106.17,75.72 106.17,76.48
  Top 1.422: v72.9,61.75 72.9,70.03 | 72.9,70.03 72.9,70.46 72.97,70.54 | v72.92,71.37 v72.92,71.35 72.92,70.05 72.9,70.03 | v163.3,90.75 148.36,90.75 | 148.36,90.75 147.93,90.75 147.85,90.68 | v146.07,90.6 148.21,90.6 148.36,90.75
  Bottom 0.254: 86.64,75.77 ADS1115-1.3 | 86.64,96.11 ADS1115-2.3
  Bottom 1.27: ADS1115-2.3 86.64,96.24 v86.64,80.29 86.64,75.77 arc-45 86.61,75.83 v86.61,80.26 | SDCARD-KANAN.6 arc-45 101.78,80.01 | v106.17,75.69 116.33,75.69 117.16,74.86 arc-45 117.35,74.41 117.35,69.85 121.23,65.97 arc45 121.67,65.79 129.03,65.79 134.54,60.38 134.54,57.25 135.33,56.36 136.36,56.36 U$2.14 136.79,55.86 136.3,55.86 136.45,56.01 138.76,56.01 | SDCARD-KANAN.6 105.74,80.19 arc-45 v106.17,80.01 | ADS1115-1.3 86.66,75.64 86.66,72.7 85.55,71.42 v72.92,71.37 | SDCARD-KANAN.6 102.13,80.26 v97.21,80.26 | 49.99,41.25 67.97,41.25 72.38,45.66 72.71,45.66 73.1,46.05 73.1,46.41 72.9,46.61 | 29.13,66.42 30.46,66.42 30.91,65.96 30.91,61.29 30.99,61.21 | JP1.3 184.15,90.22 183.82,90.55 163.5,90.55 v163.3,90.75
  Bottom 1.422: R6.1 25.15,63.86 27.71,66.42 29.13,66.42 | v31.24,57.4 31.24,59.31 30.99,59.56 30.99,59.79 30.94,59.84 30.94,61.16 30.99,61.21 | 46.38,39.01 48.62,41.25 49.99,41.25 | 138.76,56.01 141.12,56.01 143.33,58.22 | 143.43,71.17 143.43,72.87 145.16,74.6 | 163.4,90.65 v163.3,90.75 | 145.77,90.45 145.92,90.45 v146.07,90.6
  Bottom 1.676: 38.61,31.67 24.89,31.75 21.88,34.39 21.97,34.48 21.97,46.81 23.11,47.96 23.72,47.96 24.51,49.1 v31.29,49.1 | 72.9,46.61 v72.9,61.7 v72.9,61.75 | 145.16,74.6 145.16,89.84 145.77,90.45
  Bottom 1.778: 38.61,31.67 38.35,31.93 38.35,34.85 39.93,36.42 44.27,36.42 46.38,38.53 46.38,39.01
  Bottom 2.54: 143.33,58.22 143.33,71.07 143.43,71.17
N$17  (via drill 1.6)
  Top 1.27: v18.8,58.17 v3.56,58.17
  Top 1.93: v3.56,71.63 3.56,72.14 4.57,73.15 4.57,74.17 4.32,74.42
  Top 2.54: v4.32,81.03 4.32,74.42 4.32,74.17 4.06,73.91
  Bottom 1.422: v18.8,58.17 20.17,58.17 23.52,54.81 34.49,54.81 35.05,55.37 R3.1 | 161.56,73.71 157.33,73.71 153.92,77.11 153.92,92.3 158.14,96.52 158.14,96.57 158.27,96.7 192.56,96.7 192.71,96.85
  Bottom 1.778: v3.56,71.63 v3.56,58.17 3.56,7.11 4.06,6.6 4.57,6.6 6.86,4.32 7.04,3.38 193.73,3.38 193.55,5.08 195.33,6.86 196.09,6.86 196.6,7.37 196.6,92.71 196.09,93.22 195.07,93.22 193.04,95.25 193.04,96.27 192.79,96.85 192.71,96.85 | 161.56,73.71 U$2.24
  Bottom 2.54: X12.2 6.1,89.41 4.57,87.88 4.57,81.28 v4.32,81.03
N$18  (via drill 0.6)
  Top 1.27: v54.33,34.52 54.33,48.49 | 54.33,48.49 54.36,48.51 | v54.33,49.76 54.33,48.49
  Bottom 1.27: 46.84,56.36 49.15,56.36 51.08,54.43 51.08,50.62 51.79,49.91 54.18,49.91 v54.33,49.76 | 60.4,29.36 53.37,29.36 52.86,29.87 52.86,34.34 52.91,34.39 54.2,34.39 v54.33,34.52
  Bottom 1.422: U$6.3 46.84,56.36
  Bottom 1.676: 168.33,31.19 167.13,30 167.13,26.42 166.27,25.27 84.33,25.27 83.03,26.57 63.2,26.57 60.4,29.36
  Bottom 1.778: C8.+ 182.85,31.06
  Bottom 2.54: 168.33,31.19 R24.1 171.04,31.06 R23.1 182.85,31.06
N$19  (via drill 1.6)
  other vias: 1.19,1.19
N$20
  Bottom 1.27: 9.37,5.97 190.98,5.84 194.44,9.09 194.44,32.23 193.88,32.92 | R4.2 194.56,52.4 194.56,52.35
  Bottom 1.422: 6.1,16.76 6.1,8.89 6.45,8.89 9.37,5.97 | R4.2 194.46,52.93 194.06,53.34 194.06,90.53 190.25,94.34 160,94.34 158.75,93.09 158.75,92.89 | 194.56,52.35 193.88,50.98 193.88,32.92
  Bottom 1.676: U$2.26 158.33,78.75 156.54,80.54 156.54,90.68 158.75,92.89
  Bottom 1.778: 6.1,16.76 6.35,17.02 6.35,40.64 7.37,41.66
  Bottom 2.54: DHT11.2 14.22,46.48 8.89,46.48 7.37,44.96 7.37,41.66
N$21  (via drill 1.6)
  other vias: 198.68,1.19
N$22  (via drill 0.6, 0.8)  (1 unrouted)
  Top 1.27: v84.05,78.66 v97.77,78.66 | v32.72,43.08 41.81,43.08 42.16,42.72 | 42.16,42.72 42.16,42.77 42.14,42.8 | v43.23,42.82 42.27,42.82 42.16,42.72 | v163.32,92.41 147.12,92.41 147.09,92.38 146.89,92.58 v145.82,92.58 v145.8,92.58
  Top 1.422: v71.07,71.63 v71.07,71.6 71.07,62.71 | 71.07,62.71 71.07,62.36 70.94,62.23 70.94,62.2 | v70.76,61.72 70.76,62.41 71.07,62.71
  Bottom 1.27: ADS1115-1.4 ADS1115-2.4 | SDCARD-KANAN.7 116.91,77.65 116.93,77.62 118.47,77.62 119.46,76.63 119.46,70.66 122.32,67.8 123.34,67.8 | ADS1115-1.4 84.02,75.64 84.02,73.64 83.62,73.2 71.12,73.2 | ADS1115-1.4 84.05,75.72 v84.05,78.66 | 102.06,77.79 101.97,77.7 99.75,77.7 98.78,78.66 v97.84,78.66 v97.77,78.66 | 43.26,42.8 v43.23,42.82 | R5.1 25.15,44.58 25.25,44.58 26.77,43.05 32.69,43.05 v32.72,43.08 | 137.42,63.51 U$2.11 134.41,63.53 130,67.87 123.34,67.8 | 122.48,67.79 123.34,67.8 | JP1.4 186.69,90.58 184.89,92.38 163.35,92.38 v163.32,92.41
  Bottom 1.422: 71.12,73.2 71.12,71.68 v71.07,71.63 | 43.26,42.8 43.41,42.65 46.15,42.65 47.04,43.54 50.22,43.54 | 137.42,63.51 138.92,63.51 139.73,64.31 139.73,76.51 142.11,78.89 142.11,91.9 143.76,93.55 144.83,93.55 v145.8,92.58
  Bottom 1.676: v70.76,61.72 70.28,61.04 70.28,47.07 66.75,43.54 50.22,43.54 49.63,43.54
N$23
  Bottom 0.254: 13.72,68.22 X11.2
  Bottom 1.27: X11.2 16.46,71.88 33.53,71.88 35.05,70.36 R2.1
  Bottom 1.422: U$2.23 155.39,71.13 150.95,75.56 150.95,93.78 156.34,99.16
  Bottom 1.676: 156.34,99.16 195.53,99.16 195.68,99.01 195.68,96.5 196.57,95.61 199.03,95.61 199.03,4.22 198.78,3.96 196.65,3.96 196.62,3.99 196.19,3.99 195.94,3.73 195.94,0.84 4.17,0.84 4.12,0.89 4.12,3.33 3.38,4.06 0.84,4.06 0.84,72.75 2.18,74.85 6.38,74.85 10.34,69.62 X11.2
N$24
  Bottom 2.54: X5.1 89.03,15.88 R16.2
N$25  (via drill 0.6, 0.8)
  Top 1.27: v37.8,44.88 42.11,44.88 42.19,44.81 v43.13,44.81
  Top 1.422: v37.67,76.23 37.67,71.6 | 37.67,71.6 37.67,70.97 37.87,70.76 37.87,70.71 37.97,70.61 | v37.72,69.52 37.72,71.55 37.67,71.6
  Bottom 1.27: 43.16,44.88 43.16,44.83 v43.13,44.81 43.16,44.81 46.1,47.75 56.77,47.75 56.9,47.75 | U$1.3 59.87,55.45 57.23,55.45 56.79,55.02 56.79,50.09 56.82,50.06 56.77,50.01
  Bottom 1.422: v37.72,69.52 v37.67,69.47 37.47,69.27 37.47,61.39 39.09,59.79 39.09,52.45 37.8,51.16 37.8,50.6 | R7.1 35.81,78.18 37.72,76.28 v37.67,76.23 | 56.77,50.01 56.77,47.75
  Bottom 1.676: R8.1 25.4,40.64 25.4,38.61 27.18,37.34 | 39.09,52.45 39.09,51.38 38.23,50.52
  Bottom 1.93: 27.18,37.34 36.32,37.34 37.8,38.81 v37.8,44.88 37.8,50.6
N$26
  Bottom 1.27: SDCARD-KIRI.2 133.34,90.42 arc-45 133.79,90.24 134.37,89.66 134.37,73.41 134.62,73.15 134.62,72.57 135,72.19 135.13,72.19 136.19,71.13 U$2.8
N$27  (via drill 0.6)
  Top 1.422: v132,45.41 v136.73,45.39
  Bottom 1.27: 41.15,17.78 41.15,28.7 | 36.32,28.7 41.15,28.7 | 48.26,29.72 46.58,29.72 45.31,30.99 45.31,31.06 45.16,31.22 45.16,32.66 44.83,33 42.06,33 41.48,32.41 41.45,32.41 41.05,32 41.05,28.8 41.15,28.7 | 51.18,36.63 51.46,36.91 69.7,36.91 69.72,36.88 69.93,36.88 72.67,39.62 77.27,39.62 77.27,37.57 78.36,36.47 80.54,36.47 | 104.14,37.29 104.93,37.29 108.25,40.62 116.33,40.62 118.29,42.57 118.29,44.86 118.85,45.41 v132,45.41
  Bottom 1.422: 50.55,34.42 50.42,34.54 50.42,35.87 51.18,36.63
  Bottom 1.676: 48.26,29.72 50.55,32 50.55,34.42 | U$2.22 163.59,68.59 166.06,66.12 166.06,53.29 166.06,52.22 166.06,48.79 162.69,45.41 136.75,45.41 v136.73,45.39 | 80.54,36.47 82.42,36.47 83.19,37.24 104.09,37.24 104.14,37.29
  Bottom 1.778: 37.85,13.97 41.15,17.27 41.15,17.78 | R1.1 35.81,28.7 36.32,28.7
  Bottom 2.54: X10.2 37.85,13.97
N$28  (via drill 0.6)
  Top 1.27: v126.77,69.8 126.72,69.75 126.72,63.91 v126.77,63.86
  Bottom 1.27: SDCARD-KIRI.3 124.22,87.88 arc45 123.77,87.7 121.67,85.6 121.67,71.64 arc45 121.85,71.19 123.24,69.8 v126.77,69.8 | 128.25,63.68 128.07,63.86 v126.77,63.86 | 132.61,56.67 132.61,56.08 135.23,53.47 136.71,53.47 U$2.15
  Bottom 1.422: 132.61,56.67 132.61,59.31 128.25,63.68
N$29
  Bottom 1.27: SDCARD-KIRI.4 126.91,85.28 arc-45 126.46,85.09 123.95,85.09 123.88,85.02 arc45 123.88,84.57 123.88,72.39 124.02,72.07 arc45 124.47,71.88 127.76,71.88 129.54,70.1 130.71,70.1 134.76,66.05 U$2.10
N$30
  Bottom 1.27: SDCARD-KIRI.5 127,82.78 130,82.78
  Bottom 1.676: 131.04,73.1 135.55,68.59 U$2.9
  Bottom 2.54: 130,82.78 131.04,81.74 131.04,73.1
N$31
  Bottom 2.54: X1.1 15.77,31.98 18.95,31.98 22.73,28.19 R8.2
N$32
  Bottom 2.54: X3.1 46.97,16.79 R12.1
N$33  (via drill 0.6, 0.8)
  Top 1.27: v91.57,56.59 94.67,56.59 | 94.67,56.59 95.94,56.59 95.99,56.54 | v96.83,56.62 94.69,56.62 94.67,56.59 | v112.32,33.63 112.32,39.68 | 112.32,39.68 112.32,42.27 112.4,42.34 112.5,42.24 | v112.34,43.21 112.34,39.7 112.32,39.68
  Bottom 1.27: 103.33,56.64 U$3.3 96.85,56.64 v96.83,56.62 | 81.89,41.63 85.5,41.63 89.23,45.36 89.23,51.74 91.47,53.98 91.47,56.49 v91.57,56.59
  Bottom 1.422: R12.2 48.26,33.6 48.26,36.7 50.8,39.24 50.9,39.14 69.01,39.14 71.5,41.63 81.89,41.63
  Bottom 1.676: 105.77,47.32 106.1,46.41 108.76,46.41 111.35,44.4 111.35,43.59 v112.34,43.21
  Bottom 1.778: 103.33,56.64 103.76,56.21 103.76,48.87 105.31,47.32 105.77,47.32
  Bottom 2.54: v112.32,33.63 117.2,33.63 R11.1
N$34
  Bottom 2.54: X6.1 109.25,16.23 R18.1
N$35  (via drill 0.6, 0.8)
  Top 1.27: v120.57,49.89 120.57,44.27 | 120.57,44.27 120.57,43.76 120.6,43.74 | v120.73,43.05 120.73,44.12 120.57,44.27
  Bottom 1.676: U$5.3 118.77,56.64 120.55,54.86 120.55,49.91 v120.57,49.89 | v120.73,43.05 122.12,41.66 123.75,43.28 123.8,43.23 129.44,43.23 132.54,40.13 165.94,40.13 167.41,41.61 C12.+ | R19.2 103.05,31.98 106.83,35.76 107.29,36.22
  Bottom 1.93: 122.12,41.66 122.12,37.69 122.3,37.52 | 122.3,37.52 110.06,37.52 108.13,35.59 107.01,35.59 106.83,35.76 | 122.3,37.52 124.21,37.52 R20.1
N$36
  Bottom 2.54: X7.1 130.56,15.49 130.56,18.26 130.05,18.77 R20.2
N$37  (via drill 0.6, 0.8)
  Top 1.676: v126.87,49.91 126.87,44.81 | 126.87,44.81 126.87,42.19 | 126.87,42.19 126.87,41.96 126.82,41.91 126.8,41.91 126.8,42.11 126.87,42.19 | v126.95,40.66 126.95,44.73 126.87,44.81
  Bottom 1.422: 184.91,33.78 C9.+
  Bottom 1.676: U$5.5 124.21,52.58 v126.87,49.91 | 182.45,35.13 184.07,35.13 C9.+
  Bottom 2.54: v126.95,40.66 135.94,31.67 R22.2 141.2,31.42 R21.1 150.8,33.22 153.39,35.81 181.76,35.81 182.45,35.13
N$38
  Bottom 1.422: R22.1 141.02,19.05 146.3,19.05 151.64,13.72
  Bottom 2.184: 151.64,13.72 153.16,12.19 154.18,12.19 153.92,12.45 X8.1
N$39
  Bottom 2.54: R24.2 175.59,13.82 X9.1
N$40  (via drill 1.6)
  other vias: 198.68,98.81
N$41
  Bottom 1.27: ICREG.IN 49.02,93.22 51.31,95.5 C5.+
  Bottom 1.676: ICREG.IN 39.88,95.5 D1.C
N$42  (via drill 1.6)
  other vias: 1.19,98.81
N$43
  Bottom 3.81: X13.2 27.61,85.34 D1.A
N$44  (via drill 0.8)
  other vias: 126.8,69.8
N$45  (via drill 0.8)
  other vias: 163.35,92.38
N$46  (via drill 0.8)
  other vias: 163.27,90.7
N$47  (via drill 0.8)
  other vias: 164.21,18.8
N$48  (via drill 0.8)
  other vias: 164.19,27.84
N$49  (via drill 0.8)
  other vias: 155.04,31.55
N$50  (via drill 0.8)
  other vias: 136.75,49.73
N$51  (via drill 0.8)
  other vias: 136.78,47.83
N$52  (via drill 0.8)
  other vias: 131.72,47.85
N$53  (via drill 0.8)
  other vias: 116.54,52.07
N$54  (via drill 0.8)
  other vias: 120.75,43
N$55  (via drill 0.8)
  other vias: 112.32,33.6
N$56  (via drill 0.8)
  other vias: 84.71,34.8
N$57  (via drill 0.8)
  other vias: 81.64,34.04
N$58  (via drill 0.8)
  other vias: 73.99,37.26
N$59  (via drill 0.8)
  other vias: 80.01,51.21
N$60  (via drill 0.8)
  other vias: 57.33,32.11
N$61  (via drill 0.8)
  other vias: 58.95,34.82
N$62  (via drill 0.8)
  other vias: 58.95,47.52
N$63  (via drill 0.8)
  other vias: 58.52,51.61
N$64  (via drill 0.8)
  other vias: 46.2,51.56
N$65  (via drill 0.8)
  other vias: 51.16,45.39
N$66  (via drill 0.8)
  other vias: 43,44.75
N$67  (via drill 0.8)
  other vias: 43,42.77
N$68  (via drill 0.8)
  other vias: 37.82,44.83
N$69  (via drill 0.8)
  other vias: 40.74,39.88
N$70  (via drill 0.8)
  other vias: 54.28,34.52
N$71  (via drill 0.8)
  other vias: 54.36,49.76
N$72  (via drill 0.8)
  other vias: 43.46,29.77
N$73  (via drill 0.8)
  other vias: 57.38,20.8
N$74  (via drill 0.8)
  other vias: 43.84,59.36
N$75  (via drill 0.8)
  other vias: 36.35,59.18
N$76  (via drill 0.8)
  other vias: 45.09,68.78
N$77  (via drill 0.8)
  other vias: 37.69,76.2
N$78  (via drill 0.8)
  other vias: 65.99,68.17
N$79  (via drill 0.8)
  other vias: 65.91,65.28
N$80  (via drill 0.8)
  other vias: 66.01,62.59
N$81  (via drill 0.8)
  other vias: 58.37,62.64
N$82  (via drill 0.8)
  other vias: 60.63,65.33
N$83  (via drill 0.8)
  other vias: 65.05,99.31
N$84  (via drill 0.8)
  other vias: 93.47,99.26
N$85  (via drill 0.8)
  other vias: 94.03,93.52
N$86  (via drill 0.8)
  other vias: 89.13,84.3
N$87  (via drill 0.8)
  other vias: 93.95,84.3
N$88  (via drill 0.8)
  other vias: 97.28,80.24
N$89  (via drill 0.8)
  other vias: 84.02,78.66
N$90  (via drill 0.8)
  other vias: 70.74,61.67
N$91  (via drill 0.8)
  other vias: 96.88,56.67
N$92  (via drill 0.8)
  other vias: 91.52,56.59
N$93  (via drill 0.8)
  other vias: 108.2,49.25
N$94  (via drill 0.8)
  other vias: 132,45.36
N$95  (via drill 0.8)
  other vias: 136.65,45.34
N$96  (via drill 0.8)
  other vias: 126.75,63.83
N$97  (via drill 0.8)
  other vias: 146.05,90.6
N$98  (via drill 0.8)
  other vias: 178.46,57.79
N$99  (via drill 0.8)
  other vias: 126.95,40.64
VCC  (via drill 0.6, 0.8, 1.6)
  Top 1.27: v22.1,18.29 v30.48,18.29 | v38.35,26.16 v43.69,26.16 | v61.87,93.95 61.95,93.95 93.65,93.9 v94,93.55
  Top 1.422: v175.67,82.65 175.72,82.6 184.58,82.6 v184.61,82.63
  Top 1.676: v40.74,39.9 43.28,37.36 43.28,29.92 v43.43,29.77
  Top 1.778: v39.95,67.01 v39.95,67.06 39.95,73.84 40.16,74.04 v40.16,75.51 v40.16,75.56
  Bottom 1.27: SDCARD-KANAN.1 102.16,92.94 | 38.35,19.3 38.35,19.81 v38.35,26.16 | 185.67,23.11 185.93,23.11 189.23,23.11 190.75,21.59 190.75,21.18 190.73,21.21 190.73,26.95 190.65,27.03 190.65,27.13 187.96,29.82 187.96,37.41 185.42,39.95 C1.+ | 104.22,21.34 104.57,21.69 104.57,22.35 | 135.31,21.67 135.48,21.84 135.48,22.35 | C6.+ 52.91,77.55 52.91,85.27 61.59,93.95 v61.87,93.95 v61.87,93.93
  Bottom 1.422: v30.48,18.29 31.75,17.02 35.56,17.02 36.58,18.03 37.59,18.03 38.35,18.8 38.35,19.81 | 143.26,16 142.24,17.02 138.18,17.02 136.4,18.8 | U$2.30 162.04,88.47 167.79,88.47 173.61,82.65 174.17,82.65 | 166.69,22.24 166.76,22.24 167.53,22.24 167.77,22.48 167.79,22.48 167.84,22.43 167.56,22.43 167.49,22.35 167.49,21.51 | 188.29,16.05 188.98,16.74 188.98,17.25 190.75,19.02 190.75,21.18 | 84.71,22.1 85.32,22.71 85.37,22.71 | 124.89,21.23 124.82,21.31 124.82,22.35
  Bottom 1.676: 60.71,18.03 60.71,15.49 63.5,12.7 X3.3 | 102.16,92.94 101.55,93.55 v94,93.55 | 41.68,49.48 41.68,48.46 40.69,47.47 40.69,39.95 v40.74,39.9 | 44.45,26.92 44.37,26.92 43.43,27.86 v43.43,29.77 | 61.98,23.11 62.38,22.71 85.37,22.71 92.58,22.71 92.94,22.35 104.57,22.35 124.82,22.35 135.48,22.35 167.49,22.35 172.21,22.35
  Bottom 1.778: 18.8,19.05 22,15.85 X2.3 22.1,12.93 v22.1,18.29 22.1,18.8 | 21.84,18.8 22.1,18.8 | 22.1,18.8 21.59,19.3 19.3,19.3 20.57,18.03 21.08,18.03 22.1,19.05 22.1,19.3 | 60.71,24.38 59.44,26.16 58.67,26.92 44.45,26.92 v43.69,26.16 | 60.71,24.38 60.71,18.03 | 61.98,23.11 60.71,24.38 | X6.3 124.97,13.21 | X7.3 143.26,15.49 143.26,16 | 166.37,22.35 166.76,22.24 | C1.+ 184.61,45.01 v184.61,82.63 | 173.63,82.65 174.17,82.65 v175.67,82.65 | ICREG.OUT 43.2,87.1 43.2,77.8 46.33,74.68 | 46.33,74.68 C6.+ | 41.68,49.48 41.68,61.8 40.11,63.37 40.11,66.85 v39.95,67.01 | 46.33,74.68 40.95,74.68 | 40.95,74.68 40.01,75.62 | 40.95,74.68 40.95,74.78 v40.16,75.56
  Bottom 2.184: 136.4,18.8 135.31,19.89 135.31,21.67
  Bottom 2.54: X1.3 16,19.05 18.8,19.05 | X9.3 188.29,16.05 | 172.21,22.35 172.97,23.11 185.93,23.11 | X4.3 84.71,12.83 84.71,22.1 | X5.3 104.22,13.39 104.22,21.34 | X6.3 124.89,13.28 124.89,21.23 | X8.3 167.49,13.56 167.49,21.51